# EAGLE schematic central_unit (EAGLE 9.3.1)
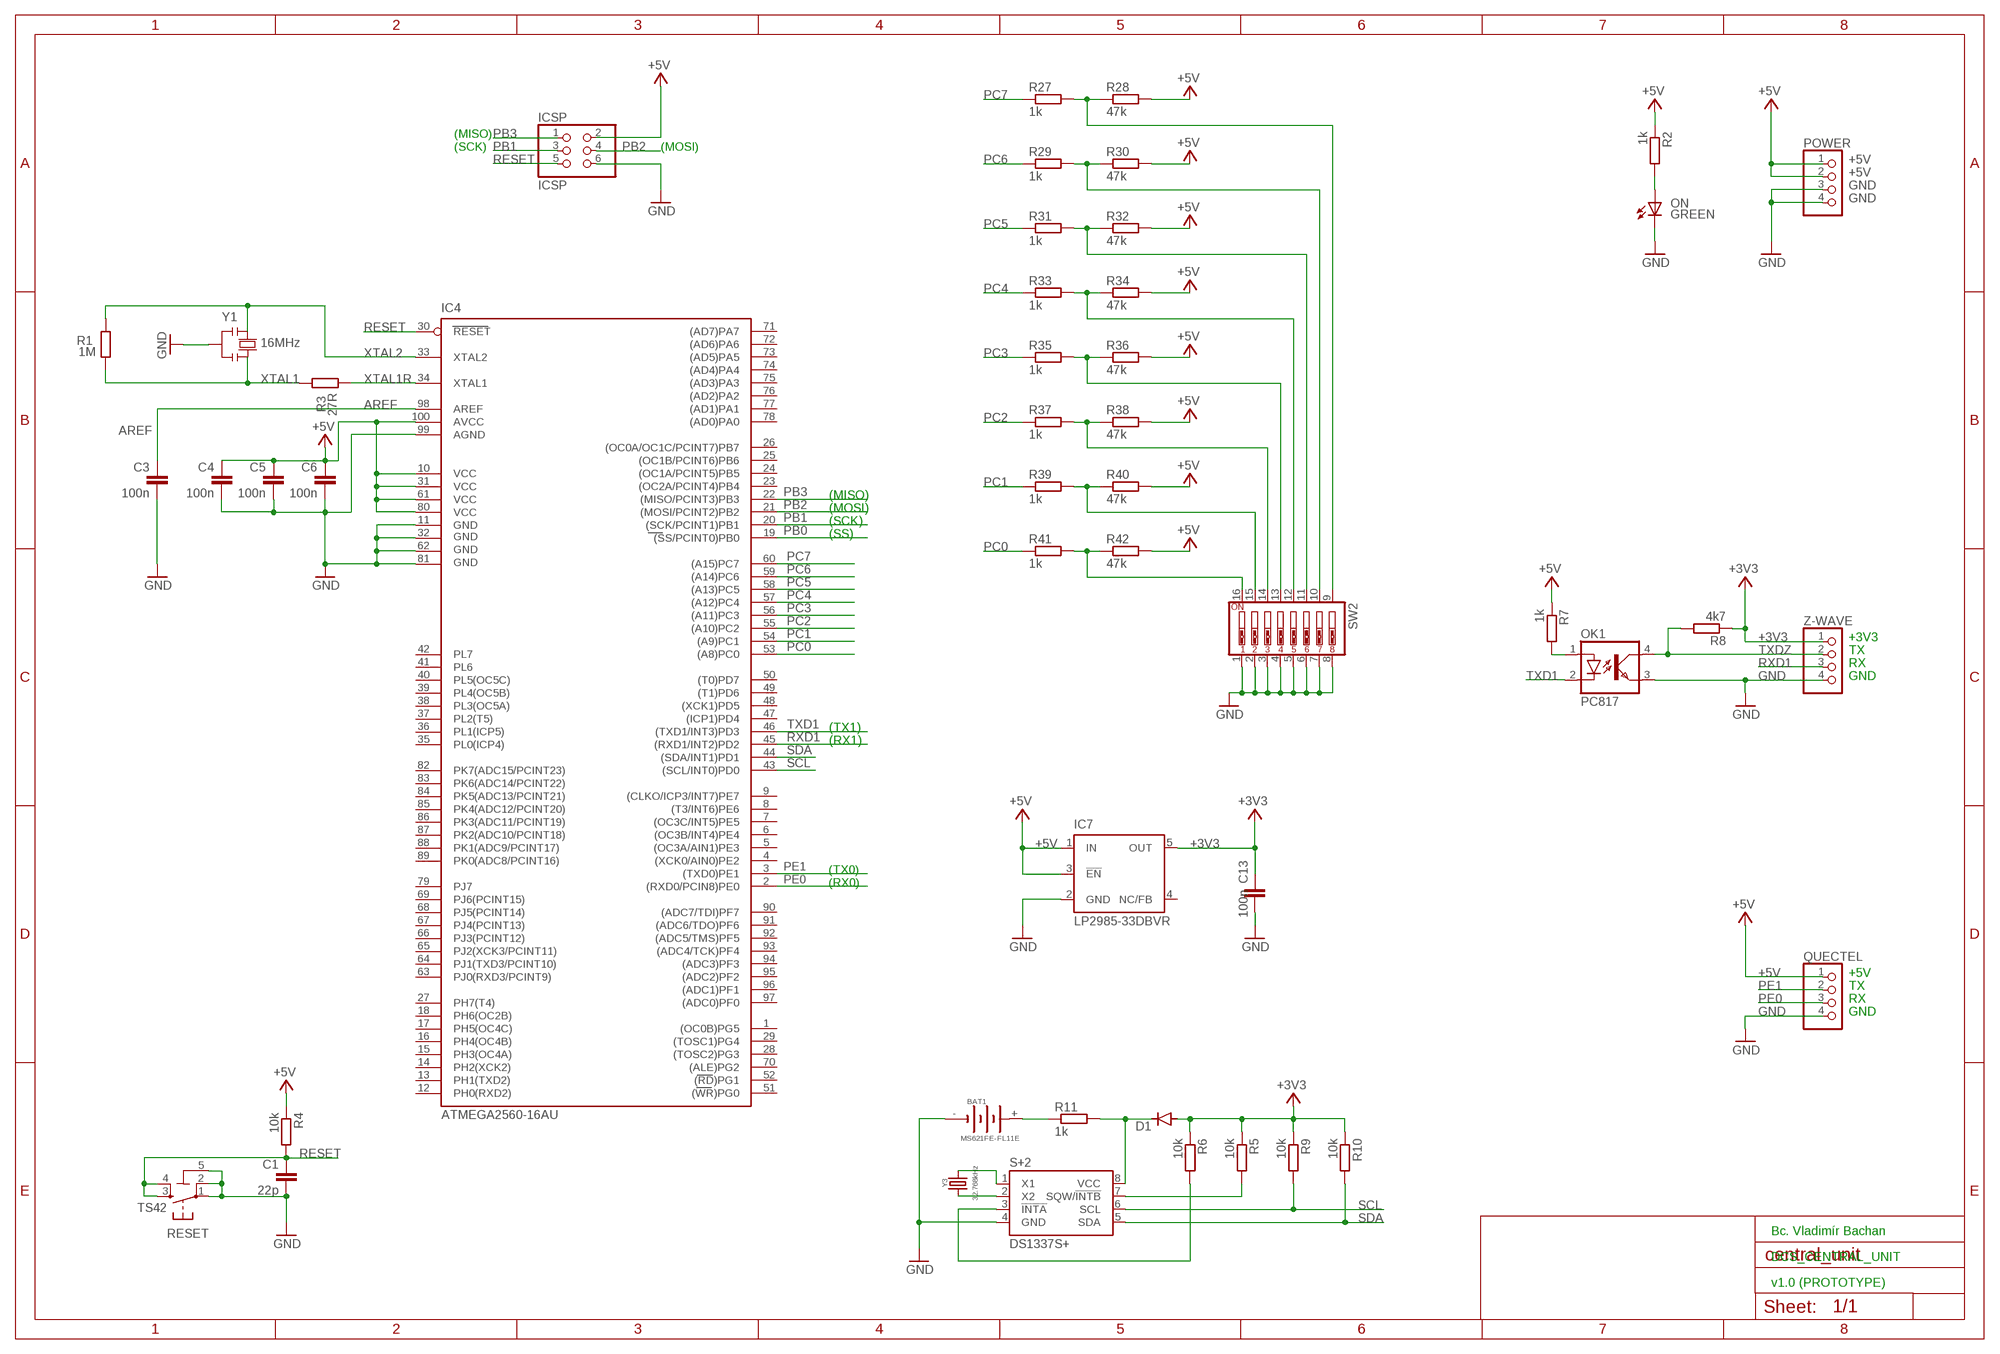
[diagram p0: schematic, sheet 1]

## Parts
BAT1  MS621FE-FL11E  [MS621FEFL11E]
C1  22p  C-EU0603-RND  [C0603-ROUND]
C3  100n  C-EU0603-RND  [C0603-ROUND]
C4  100n  C-EU0603-RND  [C0603-ROUND]
C5  100n  C-EU0603-RND  [C0603-ROUND]
C6  100n  C-EU0603-RND  [C0603-ROUND]
C13  100n  C-EU0603-RND  [C0603-ROUND]
D1  1N4148DO35-7  [DO35-7]
IC4  ATMEGA2560-16AU  ATMEGA1280-16AU  [TQFP100]
IC7  LP2985-33DBVR  TPS77033  [SOT23-DBV]
ICSP  ICSP  PINHD-2X3  [2X03]
OK1  PC817  [DIL04]
ON  GREEN  LEDCHIP-LED0805  [CHIP-LED0805]
POWER  PINHD-1X4  [1X04]
QUECTEL  PINHD-1X4  [1X04]
R1  1M  R-EU_R0603  [R0603-ROUND]
R2  1k  R-EU_R0603  [R0603]
R3  27R  R-EU_R0603  [R0603-ROUND]
R4  10k  R-EU_R0603  [R0603]
R5  10k  R-EU_R0603  [R0603]
R6  10k  R-EU_R0603  [R0603]
R7  1k  R-EU_R0603  [R0603]
R8  4k7  R-EU_R0603  [R0603]
R9  10k  R-EU_R0603  [R0603]
R10  10k  R-EU_R0603  [R0603]
R11  1k  R-EU_0207/7  [0207/7]
R27  1k  R-EU_0207/7  [0207/7]
R28  47k  R-EU_0207/7  [0207/7]
R29  1k  R-EU_0207/7  [0207/7]
R30  47k  R-EU_0207/7  [0207/7]
R31  1k  R-EU_0207/7  [0207/7]
R32  47k  R-EU_0207/7  [0207/7]
R33  1k  R-EU_0207/7  [0207/7]
R34  47k  R-EU_0207/7  [0207/7]
R35  1k  R-EU_0207/7  [0207/7]
R36  47k  R-EU_0207/7  [0207/7]
R37  1k  R-EU_0207/7  [0207/7]
R38  47k  R-EU_0207/7  [0207/7]
R39  1k  R-EU_0207/7  [0207/7]
R40  47k  R-EU_0207/7  [0207/7]
R41  1k  R-EU_0207/7  [0207/7]
R42  47k  R-EU_0207/7  [0207/7]
RESET  TS42  [TS42]
S+2  DS1337S+  [SO8]
SW2  SW_DIP-8  [EDG-08]
Y1  16MHz  RESONATORMU  [RESONATOR]
Y3  32.768kHz  CFPX–217  [CFPX–217]
Z-WAVE  PINHD-1X4  [1X04]

## Nets
#INTA_RTC: R6.2 S+2.3(!INTA)
+3V3: C13.2 D1.A IC7.5(OUT) R5.1 R6.1 R8.1 R9.1 R10.1 Z-WAVE.1
+5V: C4.1 C5.1 C6.1 IC4.10(VCC) IC4.31(VCC1) IC4.61(VCC2) IC4.80(VCC3) IC4.100(AVCC) IC7.1(IN) IC7.3(!EN) ICSP.2 POWER.1 POWER.2 QUECTEL.1 R2.1 R4.1 R7.1 R28.2 R30.2 R32.2 R34.2 R36.2 R38.2 R40.2 R42.2
AREF: C3.1 IC4.98(AREF)
GND: BAT1.- C1.2 C3.2 C4.2 C5.2 C6.2 C13.1 IC4.11(GND) IC4.32(GND1) IC4.62(GND2) IC4.81(GND3) IC4.99(AGND) IC7.2(GND) ICSP.6 OK1.3(EMIT) ON.C POWER.3 POWER.4 QUECTEL.4 RESET.1 RESET.2 RESET.5(5-GND) S+2.4(GND) SW2.1 SW2.2 SW2.3 SW2.4 SW2.5 SW2.6 SW2.7 SW2.8 Y1.2 Z-WAVE.4
N$1: D1.C R11.2 S+2.8(VCC)
N$2: S+2.2(X2) Y3.2
N$3: ON.A R2.2
N$4: S+2.1(X1) Y3.1
N$5: BAT1.+ R11.1
N$6: OK1.1(A) R7.2
N$7: R5.2 S+2.7(SQW/!INTB!)
N$22: R27.2 R28.1 SW2.9
N$23: R29.2 R30.1 SW2.10
N$24: R31.2 R32.1 SW2.11
N$25: R33.2 R34.1 SW2.12
N$26: R35.2 R36.1 SW2.13
N$27: R37.2 R38.1 SW2.14
N$28: R39.2 R40.1 SW2.15
N$29: R41.2 R42.1 SW2.16
PB0: IC4.19((SS/PCINT0)PB0)
PB1: IC4.20((SCK/PCINT1)PB1) ICSP.3
PB2: IC4.21((MOSI/PCINT2)PB2) ICSP.4
PB3: IC4.22((MISO/PCINT3)PB3) ICSP.1
PC0: IC4.53((A8)PC0) R41.1
PC1: IC4.54((A9)PC1) R39.1
PC2: IC4.55((A10)PC2) R37.1
PC3: IC4.56((A11)PC3) R35.1
PC4: IC4.57((A12)PC4) R33.1
PC5: IC4.58((A13)PC5) R31.1
PC6: IC4.59((A14)PC6) R29.1
PC7: IC4.60((A15)PC7) R27.1
PE0: IC4.2((RXD0/PCIN8)PE0) QUECTEL.3
PE1: IC4.3((TXD0)PE1) QUECTEL.2
RESET: C1.1 IC4.30(RESET) ICSP.5 R4.2 RESET.3 RESET.4
RXD1: IC4.45((RXD1/INT2)PD2) Z-WAVE.3
SCL: IC4.43((SCL/INT0)PD0) R9.2 S+2.6(SCL)
SDA: IC4.44((SDA/INT1)PD1) R10.2 S+2.5(SDA)
TXD1: IC4.46((TXD1/INT3)PD3) OK1.2(C)
TXDZ: OK1.4(COL) R8.2 Z-WAVE.2
XTAL1: R1.1 R3.2 Y1.3
XTAL1R: IC4.34(XTAL1) R3.1
XTAL2: IC4.33(XTAL2) R1.2 Y1.1
Unconnected: IC4.1((OC0B)PG5) IC4.4((XCK0/AIN0)PE2) IC4.5((OC3A/AIN1)PE3) IC4.6((OC3B/INT4)PE4) IC4.7((OC3C/INT5)PE5) IC4.8((T3/INT6)PE6) IC4.9((CLKO/ICP3/INT7)PE7) IC4.12(PH0(RXD2)) IC4.13(PH1(TXD2)) IC4.14(PH2(XCK2)) IC4.15(PH3(OC4A)) IC4.16(PH4(OC4B)) IC4.17(PH5(OC4C)) IC4.18(PH6(OC2B)) IC4.23((OC2A/PCINT4)PB4) IC4.24((OC1A/PCINT5)PB5) IC4.25((OC1B/PCINT6)PB6) IC4.26((OC0A/OC1C/PCINT7)PB7) IC4.27(PH7(T4)) IC4.28((TOSC2)PG3) IC4.29((TOSC1)PG4) IC4.35(PL0(ICP4)) IC4.36(PL1(ICP5)) IC4.37(PL2(T5)) IC4.38(PL3(OC5A)) IC4.39(PL4(OC5B)) IC4.40(PL5(OC5C)) IC4.41(PL6) IC4.42(PL7) IC4.47((ICP1)PD4) IC4.48((XCK1)PD5) IC4.49((T1)PD6) IC4.50((T0)PD7) IC4.51((WR)PG0) IC4.52((RD)PG1) IC4.63(PJ0(RXD3/PCINT9)) IC4.64(PJ1(TXD3/PCINT10)) IC4.65(PJ2(XCK3/PCINT11)) IC4.66(PJ3(PCINT12)) IC4.67(PJ4(PCINT13)) IC4.68(PJ5(PCINT14)) IC4.69(PJ6(PCINT15)) IC4.70((ALE)PG2) IC4.71((AD7)PA7) IC4.72((AD6)PA6) IC4.73((AD5)PA5) IC4.74((AD4)PA4) IC4.75((AD3)PA3) IC4.76((AD2)PA2) IC4.77((AD1)PA1) IC4.78((AD0)PA0) IC4.79(PJ7) IC4.82(PK7(ADC15/PCINT23)) IC4.83(PK6(ADC14/PCINT22)) IC4.84(PK5(ADC13/PCINT21)) IC4.85(PK4(ADC12/PCINT20)) IC4.86(PK3(ADC11/PCINT19)) IC4.87(PK2(ADC10/PCINT18)) IC4.88(PK1(ADC9/PCINT17)) IC4.89(PK0(ADC8/PCINT16)) IC4.90((ADC7/TDI)PF7) IC4.91((ADC6/TDO)PF6) IC4.92((ADC5/TMS)PF5) IC4.93((ADC4/TCK)PF4) IC4.94((ADC3)PF3) IC4.95((ADC2)PF2) IC4.96((ADC1)PF1) IC4.97((ADC0)PF0) IC7.4(NC/FB)

## Notes on the sheet
- (MISO)
- (SCK) | (MOSI)
- (MISO)
- (MOSI)
- (SCK)
- (SS)
- +3V3
- TX
- RX
- GND
- (TX1)
- (RX1)
- (TX0)
- (RX0)
- +5V
- TX
- RX
- GND
- Bc. Vladimír Bachan
- DCS_CENTRAL_UNIT
- v1.0 (PROTOTYPE)

## Library data of the parts
BAT1 = Battery:MS621FE-FL11E; FARNELL: 1614634
C1 C3-C6 C13 = SmartPrj:C-EU: CAPACITOR, European symbol
D1 = diode:1N4148: DIODE high speed (Philips)
IC4 = atmel-2005:ATMEGA*: MICROCONTROLLER 64/128/256 Kbytes FLASH 4 Kbytes EEPROM 8 Kbytes SRAM 86 General Purpose I/O pins 12-channels16-bit PWM 4 x Serial USARTs 16-channels 10-bit A/D
IC7 = texas:TPS770*: ULTRALOW-POWER 50-mA LOW-DROPOUT LINEAR REGULATORS 50-mA Low-Dropout Regulator Source: http://focus.ti.com/lit/ds/symlink/tps77001.pdf
ICSP = pinhead:PINHD-2X3: PIN HEADER
OK1 = optocoupler:PC817: SHARP OPTO COUPLER; MPN: PC817X4J000F; OC_FARNELL: 9707727; OC_NEWARK: 97K7059
ON = led:LED: LED OSRAM: - CHIPLED LG R971, LG N971, LY N971, LG Q971, LY Q971, LO R971, LY R971 LH N974, LH R974 LS Q976, LO Q976, LY Q976 LO Q996 - Hyper CHIPLED LW Q18S LB Q993, LB Q99A, LB R99A - SideLED LS A670, LO A670, LY A670, LG A670, LP A670 LB A673, LV A673, LT A673, LW A673 LH A674 LY A675 LS A676, LA A676, LO A676, LY A676, LW A676 LS A679, LY A679, LG A679 - Hyper Micro SIDELED® LS Y876, LA Y876, LO Y876, LY Y876 LT Y87S - SmartLED LW L88C, LW L88S LB L89C, LB L89S, LG L890 LS L89K, LO L89K, LY L89K LS L896, LA L896, LO L896, LY L896 - TOPLED LS T670, LO T670, LY T670, LG T670, LP T670 LSG T670, LSP T670, LSY T670, LOP T670, LYG T670 LG T671, LOG T671, LSG T671 LB T673, LV T673, LT T673, LW T673 LH T674 LS T676, LA T676, LO T676, LY T676, LB T676, LH T676, LSB T676, LW T676 LB T67C, LV T67C, LT T67C, LS T67K, LO T67K, LY T67K, LW E67C LS E67B, LA E67B, LO E67B, LY E67B, LB E67C, LV E67C, LT E67C LW T67C LS T679, LY T679, LG T679 LS T770, LO T770, LY T770, LG T770, LP T770 LB T773, LV T773, LT T773, LW T773 LH T774 LS E675, LA E675, LY E675, LS T675 LS T776, LA T776, LO T776, LY T776, LB T776 LHGB T686 LT T68C, LB T68C - Hyper Mini TOPLED® LB M676 - Mini TOPLED Santana® LG M470 LS M47K, LO M47K, LY M47K Source: http://www.osram.convergy.de LUXEON: - LUMILED® LXK2-PW12-R00, LXK2-PW12-S00, LXK2-PW14-U00, LXK2-PW14-V00 LXK2-PM12-R00, LXK2-PM12-S00, LXK2-PM14-U00 LXK2-PE12-Q00, LXK2-PE12-R00, LXK2-PE12-S00, LXK2-PE14-T00, LXK2-PE14-U00 LXK2-PB12-K00, LXK2-PB12-L00, LXK2-PB12-M00, LXK2-PB14-N00, LXK2-PB14-P00, LXK2-PB14-Q00 LXK2-PR12-L00, LXK2-PR12-M00, LXK2-PR14-Q00, LXK2-PR14-R00 LXK2-PD12-Q00, LXK2-PD12-R00, LXK2-PD12-S00 LXK2-PH12-R00, LXK2-PH12-S00 LXK2-PL12-P00, LXK2-PL12-Q00, LXK2-PL12-R00 Source: www.luxeon.com KINGBRIGHT: KA-3528ASYC Source: www.kingbright.com
POWER QUECTEL Z-WAVE = pinhead:PINHD-1X4: PIN HEADER
R1 R3 = SmartPrj:R-EU_: RESISTOR, European symbol
R2 R4-R11 R27-R42 = rcl:R-EU_: RESISTOR, European symbol; SPICEPREFIX: R
RESET = st-mod v1.4:TS42: TS42 Dongnan Electronics Tact switch VDC 12V - 50mA
S+2 = AjRTC:DS1337: DS1337 I2C serial real-time clock Low-power clock/calendar with two programmable time-of-day alarms and a programmable square-wave output. http://pdfserv.maxim-ic.com/en/ds/DS1337-DS1337C.pdf
SW2 = special:SW_DIP-8: DIP SWITCH
Y1 = SmartPrj:RESONATOR
Y3 = Crystals:CFPX–217; TME: CFPX-217